# Altium schematic sheet isolation-alt.SchDoc
size A4; SheetNumber: 5; SheetTotal: 14
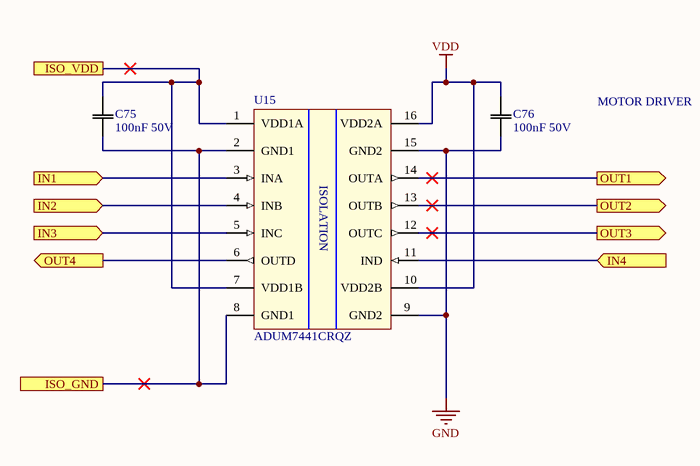
[diagram p0: isolation-alt.SchDoc]

## Parts
C75  100nF 50V  [0603]
C76  100nF 50V  [0603]
U15  ADUM7441CRQZ  [SOP64P600X175-16N]

## Ports
IN1 (in), IN2 (in), IN3 (in), IN4 (in), ISO_GND, ISO_VDD, OUT1 (out), OUT2 (out), OUT3 (out), OUT4 (out)

## Nets
GND: C76.1(C1) U15.9(GND2) U15.15(GND2)
VDD: C76.2(C2) U15.10(VDD2B) U15.16(VDD2A)
IN1: U15.3(INA) ; port IN1
IN2: U15.4(INB) ; port IN2
IN3: U15.5(INC) ; port IN3
IN4: U15.11(IND) ; port IN4
ISO_GND: C75.1(C1) U15.2(GND1) U15.8(GND1) ; port ISO_GND
ISO_VDD: C75.2(C2) U15.1(VDD1A) U15.7(VDD1B) ; port ISO_VDD
OUT1: U15.14(OUTA) ; port OUT1
OUT2: U15.13(OUTB) ; port OUT2
OUT3: U15.12(OUTC) ; port OUT3
OUT4: U15.6(OUTD) ; port OUT4

## Notes on the sheet
- MOTOR DRIVER
- (in symbol ISO ADUM7441CRQZ) ISOLATION

## Library data of the parts
C75 C76 = CAP 100nF 50V: Default Symbol for Capacitors; Manufacturer Part Number 1: CC0603KPX7R9BB104; Temperature Coefficient: X7R; Tolerance: 10%; Part Number: CAP 100nF 50V; Supplier 1: Digi-Key; Supplier Part Number 1: 311-3567-1-ND; Manufacturer Part Number 2: 0805J0500104KJT; Supplier 2: Digi-Key; Supplier Part Number 2: 1608-1458-1-ND; Value: 100nF; Rating: 50V
U15 = ISO ADUM7441CRQZ: Digital Isolator CMOS 4-CH 150Mbps 16-Pin QSOP T/R; Part Number: ISO ADUM7441CRQZ; Manufacturer Part Number 1: ADUM7441CRQZ; Supplier 1: Digi-Key; Supplier Part Number 1: 505-ADUM7441CRQZ-ND-ND; Supplier URL 1: https://www.digikey.ca/en/products/detail/analog-devices-inc/ADUM7441CRQZ/2237744